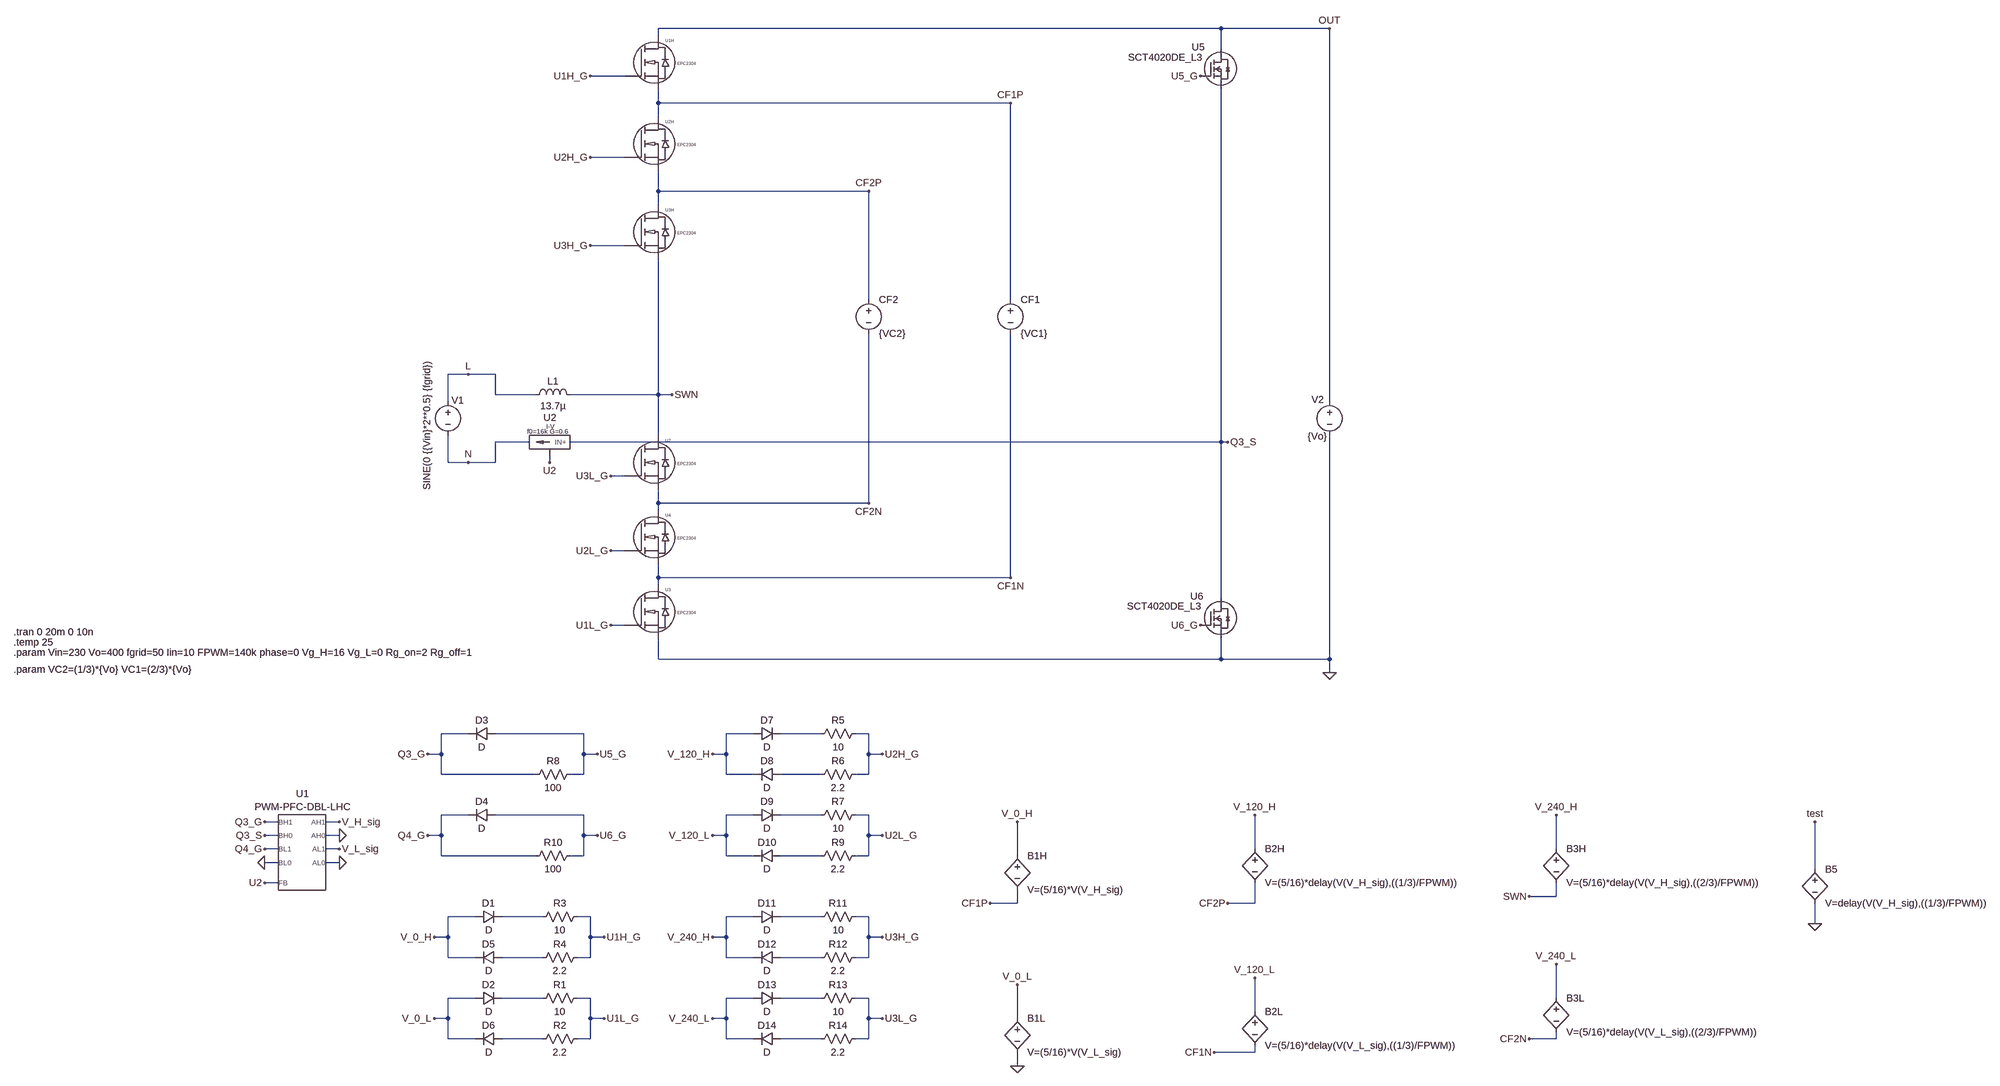
[diagram p0: schematic AC-DC Totem-Pole Bridgeless PFC Vin=200V Iin=100A Synchronous FETs.asc]
AC-DC Totem-Pole Bridgeless PFC Vin=200V Iin=100A Synchronous FETs.asc, the LTspice schematic file:
Version 4.1
SHEET 1 3608 1788
WIRE 1520 -688 192 -688
WIRE 1776 -688 1520 -688
WIRE 192 -672 192 -688
WIRE 1520 -640 1520 -688
WIRE 112 -576 32 -576
WIRE 192 -512 192 -544
WIRE 1024 -512 192 -512
WIRE 192 -480 192 -512
WIRE 112 -384 32 -384
WIRE 192 -304 192 -352
WIRE 688 -304 192 -304
WIRE 192 -272 192 -304
WIRE 112 -176 32 -176
WIRE 688 -48 688 -304
WIRE 1024 -48 1024 -512
WIRE -256 128 -304 128
WIRE -192 128 -256 128
WIRE -192 176 -192 128
WIRE -96 176 -192 176
WIRE 192 176 192 -144
WIRE 192 176 -16 176
WIRE 224 176 192 176
WIRE -304 192 -304 128
WIRE 1776 192 1776 -688
WIRE 192 272 192 176
WIRE -112 288 -192 288
WIRE 1520 288 1520 -544
WIRE 1520 288 -16 288
WIRE 1536 288 1520 288
WIRE -304 336 -304 272
WIRE -256 336 -304 336
WIRE -192 336 -192 288
WIRE -192 336 -256 336
WIRE -64 336 -64 320
WIRE 112 368 80 368
WIRE 192 432 192 400
WIRE 688 432 688 32
WIRE 688 432 192 432
WIRE 192 448 192 432
WIRE 112 544 80 544
WIRE 192 608 192 576
WIRE 1024 608 1024 32
WIRE 1024 608 192 608
WIRE 192 624 192 608
WIRE 1520 656 1520 288
WIRE 112 720 80 720
WIRE 192 800 192 752
WIRE 1520 800 1520 752
WIRE 1520 800 192 800
WIRE 1776 800 1776 272
WIRE 1776 800 1520 800
WIRE 1776 832 1776 800
WIRE -256 976 -320 976
WIRE 16 976 -192 976
WIRE 416 976 352 976
WIRE 576 976 480 976
WIRE 688 976 656 976
WIRE -320 1024 -320 976
WIRE -320 1024 -352 1024
WIRE 16 1024 16 976
WIRE 48 1024 16 1024
WIRE 352 1024 352 976
WIRE 352 1024 320 1024
WIRE 688 1024 688 976
WIRE 720 1024 688 1024
WIRE -320 1072 -320 1024
WIRE -96 1072 -320 1072
WIRE 16 1072 16 1024
WIRE 16 1072 -16 1072
WIRE 352 1072 352 1024
WIRE 416 1072 352 1072
WIRE 576 1072 480 1072
WIRE 688 1072 688 1024
WIRE 688 1072 656 1072
WIRE -256 1168 -320 1168
WIRE 16 1168 -192 1168
WIRE 416 1168 352 1168
WIRE 576 1168 480 1168
WIRE 688 1168 656 1168
WIRE -704 1184 -736 1184
WIRE -560 1184 -592 1184
WIRE -704 1216 -736 1216
WIRE -560 1216 -592 1216
WIRE -320 1216 -320 1168
WIRE -320 1216 -352 1216
WIRE 16 1216 16 1168
WIRE 48 1216 16 1216
WIRE 352 1216 352 1168
WIRE 352 1216 320 1216
WIRE 688 1216 688 1168
WIRE 720 1216 688 1216
WIRE -704 1248 -736 1248
WIRE -560 1248 -592 1248
WIRE 1600 1248 1600 1168
WIRE 2384 1248 2384 1168
WIRE -320 1264 -320 1216
WIRE -96 1264 -320 1264
WIRE 16 1264 16 1216
WIRE 16 1264 -16 1264
WIRE 352 1264 352 1216
WIRE 416 1264 352 1264
WIRE 576 1264 480 1264
WIRE 688 1264 688 1216
WIRE 688 1264 656 1264
WIRE 1040 1264 1040 1184
WIRE -704 1280 -736 1280
WIRE -560 1280 -592 1280
WIRE 3152 1296 3152 1184
WIRE -704 1328 -736 1328
WIRE 2384 1360 2384 1328
WIRE 2384 1360 2320 1360
WIRE 1040 1376 1040 1344
WIRE 1040 1376 976 1376
WIRE 1600 1376 1600 1328
WIRE 1600 1376 1536 1376
WIRE -240 1408 -304 1408
WIRE -80 1408 -176 1408
WIRE 32 1408 0 1408
WIRE 416 1408 352 1408
WIRE 576 1408 480 1408
WIRE 688 1408 656 1408
WIRE 3152 1424 3152 1376
WIRE -304 1456 -304 1408
WIRE -304 1456 -336 1456
WIRE 32 1456 32 1408
WIRE 64 1456 32 1456
WIRE 352 1456 352 1408
WIRE 352 1456 320 1456
WIRE 688 1456 688 1408
WIRE 720 1456 688 1456
WIRE -304 1504 -304 1456
WIRE -240 1504 -304 1504
WIRE -80 1504 -176 1504
WIRE 32 1504 32 1456
WIRE 32 1504 0 1504
WIRE 352 1504 352 1456
WIRE 416 1504 352 1504
WIRE 576 1504 480 1504
WIRE 688 1504 688 1456
WIRE 688 1504 656 1504
WIRE -240 1600 -304 1600
WIRE -80 1600 -176 1600
WIRE 32 1600 0 1600
WIRE 416 1600 352 1600
WIRE 576 1600 480 1600
WIRE 688 1600 656 1600
WIRE 2384 1600 2384 1520
WIRE 1600 1632 1600 1552
WIRE -304 1648 -304 1600
WIRE -304 1648 -336 1648
WIRE 32 1648 32 1600
WIRE 64 1648 32 1648
WIRE 352 1648 352 1600
WIRE 352 1648 320 1648
WIRE 688 1648 688 1600
WIRE 720 1648 688 1648
WIRE 1040 1648 1040 1568
WIRE -304 1696 -304 1648
WIRE -240 1696 -304 1696
WIRE -80 1696 -176 1696
WIRE 32 1696 32 1648
WIRE 32 1696 0 1696
WIRE 352 1696 352 1648
WIRE 416 1696 352 1696
WIRE 576 1696 480 1696
WIRE 688 1696 688 1648
WIRE 688 1696 656 1696
WIRE 2384 1696 2384 1680
WIRE 2384 1696 2320 1696
WIRE 1600 1728 1600 1712
WIRE 1600 1728 1504 1728
WIRE 1040 1760 1040 1728
FLAG 1776 832 0
FLAG 1776 -688 OUT
FLAG 224 176 SWN
FLAG 1536 288 Q3_S
FLAG -560 1184 V_H_sig
FLAG -560 1248 V_L_sig
FLAG -560 1280 0
FLAG -736 1184 Q3_G
FLAG -736 1216 Q3_S
FLAG -736 1248 Q4_G
FLAG -736 1280 0
FLAG -736 1328 U2
FLAG -64 336 U2
FLAG -336 1456 V_0_H
FLAG -336 1648 V_0_L
FLAG 64 1456 U1H_G
FLAG 64 1648 U1L_G
FLAG -352 1024 Q3_G
FLAG -352 1216 Q4_G
FLAG 48 1024 U5_G
FLAG 48 1216 U6_G
FLAG 32 -576 U1H_G
FLAG 80 720 U1L_G
FLAG 1472 -576 U5_G
FLAG 1472 720 U6_G
FLAG 1600 1168 V_120_H
FLAG 2384 1168 V_240_H
FLAG 1040 1760 0
FLAG 1040 1568 V_0_L
FLAG 1040 1184 V_0_H
FLAG -560 1216 0
FLAG -256 128 L
FLAG -256 336 N
FLAG 1600 1552 V_120_L
FLAG 2384 1520 V_240_L
FLAG 320 1024 V_120_H
FLAG 320 1216 V_120_L
FLAG 720 1024 U2H_G
FLAG 720 1216 U2L_G
FLAG 320 1456 V_240_H
FLAG 320 1648 V_240_L
FLAG 720 1456 U3H_G
FLAG 720 1648 U3L_G
FLAG 32 -384 U2H_G
FLAG 32 -176 U3H_G
FLAG 1024 -512 CF1P
FLAG 688 -304 CF2P
FLAG 80 544 U2L_G
FLAG 80 368 U3L_G
FLAG 1024 608 CF1N
FLAG 688 432 CF2N
FLAG 976 1376 CF1P
FLAG 1536 1376 CF2P
FLAG 2320 1360 SWN
FLAG 1504 1728 CF1N
FLAG 2320 1696 CF2N
FLAG 3152 1424 0
FLAG 3152 1184 test
SYMBOL ind -112 192 R270
WINDOW 0 32 56 VTop 2
WINDOW 3 5 56 VBottom 2
SYMATTR InstName L1
SYMATTR Value 13.7µ
SYMATTR SpiceLine Rser=4.2m
SYMBOL voltage -304 176 M0
WINDOW 123 0 0 Left 2
WINDOW 39 0 0 Left 2
WINDOW 3 49 -79 VRight 2
WINDOW 0 -38 13 Left 2
SYMATTR Value SINE(0 {{Vin}*2**0.5} {fgrid})
SYMATTR InstName V1
SYMBOL voltage 1776 176 M0
WINDOW 123 0 0 Left 2
WINDOW 39 0 0 Left 2
WINDOW 0 13 12 Left 2
WINDOW 3 6 98 Left 2
SYMATTR InstName V2
SYMATTR Value {Vo}
SYMBOL I-V -80 288 M0
WINDOW 0 -17 -42 Bottom 2
WINDOW 3 -18 -47 Top 1
WINDOW 39 -61 -25 Left 1
SYMATTR InstName U2
SYMATTR SpiceLine f0=16k G=0.6
SYMBOL res 16 1392 R90
WINDOW 0 0 56 VBottom 2
WINDOW 3 32 56 VTop 2
SYMATTR InstName R3
SYMATTR Value 10
SYMBOL res 16 1488 R90
WINDOW 0 0 56 VBottom 2
WINDOW 3 32 56 VTop 2
SYMATTR InstName R4
SYMATTR Value 2.2
SYMBOL res 0 1056 R90
WINDOW 0 0 56 VBottom 2
WINDOW 3 32 56 VTop 2
SYMATTR InstName R8
SYMATTR Value 100
SYMBOL res 0 1248 R90
WINDOW 0 0 56 VBottom 2
WINDOW 3 32 56 VTop 2
SYMATTR InstName R10
SYMATTR Value 100
SYMBOL SCT4020DE_L3 1472 -640 R0
WINDOW 0 -21 -4 Left 2
WINDOW 3 -171 20 Left 2
SYMATTR InstName U5
SYMBOL SCT4020DE_L3 1472 656 R0
WINDOW 0 -24 -4 Left 2
WINDOW 3 -173 19 Left 2
SYMATTR InstName U6
SYMBOL PWM-PFC-DBL-LHC -656 1312 R0
WINDOW 39 -367 56 Invisible 2
WINDOW 40 -368 90 Invisible 2
SYMATTR SpiceLine fps=fgrid phase=0 td1=15n td2=15n tr1=6.3n tf1=2.3n tr2=6.3n tf2=2.3n fsw=FPWM
SYMATTR SpiceLine2 Vg_H=16 Vg_L=0 Rso1=0 Rsi1=0 Rso2=0 Rsi2=0 f02=8k GA=12500 Vref=0.3
SYMATTR InstName U1
SYMBOL diode -192 960 R90
WINDOW 0 0 32 VBottom 2
WINDOW 3 32 32 VTop 2
SYMATTR InstName D3
SYMBOL diode -192 1152 R90
WINDOW 0 0 32 VBottom 2
WINDOW 3 32 32 VTop 2
SYMATTR InstName D4
SYMBOL bv 1600 1232 R0
SYMATTR InstName B2H
SYMATTR Value V=(5/16)*delay(V(V_H_sig),((1/3)/FPWM))
SYMBOL bv 2384 1232 R0
SYMATTR InstName B3H
SYMATTR Value V=(5/16)*delay(V(V_H_sig),((2/3)/FPWM))
SYMBOL diode -240 1392 M90
WINDOW 0 0 32 VBottom 2
WINDOW 3 32 32 VTop 2
SYMATTR InstName D1
SYMBOL diode -176 1520 M270
WINDOW 0 32 32 VTop 2
WINDOW 3 0 32 VBottom 2
SYMATTR InstName D5
SYMBOL res 16 1584 R90
WINDOW 0 0 56 VBottom 2
WINDOW 3 32 56 VTop 2
SYMATTR InstName R1
SYMATTR Value 10
SYMBOL res 16 1680 R90
WINDOW 0 0 56 VBottom 2
WINDOW 3 32 56 VTop 2
SYMATTR InstName R2
SYMATTR Value 2.2
SYMBOL diode -240 1584 M90
WINDOW 0 0 32 VBottom 2
WINDOW 3 32 32 VTop 2
SYMATTR InstName D2
SYMBOL diode -176 1712 M270
WINDOW 0 32 32 VTop 2
WINDOW 3 0 32 VBottom 2
SYMATTR InstName D6
SYMBOL bv 1040 1632 R0
SYMATTR InstName B1L
SYMATTR Value V=(5/16)*V(V_L_sig)
SYMBOL bv 1040 1248 R0
SYMATTR InstName B1H
SYMATTR Value V=(5/16)*V(V_H_sig)
SYMBOL bv 1600 1616 R0
SYMATTR InstName B2L
SYMATTR Value V=(5/16)*delay(V(V_L_sig),((1/3)/FPWM))
SYMBOL bv 2384 1584 R0
SYMATTR InstName B3L
SYMATTR Value V=(5/16)*delay(V(V_L_sig),((2/3)/FPWM))
SYMBOL res 672 960 R90
WINDOW 0 0 56 VBottom 2
WINDOW 3 32 56 VTop 2
SYMATTR InstName R5
SYMATTR Value 10
SYMBOL res 672 1056 R90
WINDOW 0 0 56 VBottom 2
WINDOW 3 32 56 VTop 2
SYMATTR InstName R6
SYMATTR Value 2.2
SYMBOL diode 416 960 M90
WINDOW 0 0 32 VBottom 2
WINDOW 3 32 32 VTop 2
SYMATTR InstName D7
SYMBOL diode 480 1088 M270
WINDOW 0 32 32 VTop 2
WINDOW 3 0 32 VBottom 2
SYMATTR InstName D8
SYMBOL res 672 1152 R90
WINDOW 0 0 56 VBottom 2
WINDOW 3 32 56 VTop 2
SYMATTR InstName R7
SYMATTR Value 10
SYMBOL res 672 1248 R90
WINDOW 0 0 56 VBottom 2
WINDOW 3 32 56 VTop 2
SYMATTR InstName R9
SYMATTR Value 2.2
SYMBOL diode 416 1152 M90
WINDOW 0 0 32 VBottom 2
WINDOW 3 32 32 VTop 2
SYMATTR InstName D9
SYMBOL diode 480 1280 M270
WINDOW 0 32 32 VTop 2
WINDOW 3 0 32 VBottom 2
SYMATTR InstName D10
SYMBOL res 672 1392 R90
WINDOW 0 0 56 VBottom 2
WINDOW 3 32 56 VTop 2
SYMATTR InstName R11
SYMATTR Value 10
SYMBOL res 672 1488 R90
WINDOW 0 0 56 VBottom 2
WINDOW 3 32 56 VTop 2
SYMATTR InstName R12
SYMATTR Value 2.2
SYMBOL diode 416 1392 M90
WINDOW 0 0 32 VBottom 2
WINDOW 3 32 32 VTop 2
SYMATTR InstName D11
SYMBOL diode 480 1520 M270
WINDOW 0 32 32 VTop 2
WINDOW 3 0 32 VBottom 2
SYMATTR InstName D12
SYMBOL res 672 1584 R90
WINDOW 0 0 56 VBottom 2
WINDOW 3 32 56 VTop 2
SYMATTR InstName R13
SYMATTR Value 10
SYMBOL res 672 1680 R90
WINDOW 0 0 56 VBottom 2
WINDOW 3 32 56 VTop 2
SYMATTR InstName R14
SYMATTR Value 2.2
SYMBOL diode 416 1584 M90
WINDOW 0 0 32 VBottom 2
WINDOW 3 32 32 VTop 2
SYMATTR InstName D13
SYMBOL diode 480 1712 M270
WINDOW 0 32 32 VTop 2
WINDOW 3 0 32 VBottom 2
SYMATTR InstName D14
SYMBOL EPCGaN 112 -576 R0
SYMATTR InstName U1H
SYMBOL EPCGaN 112 -384 R0
SYMATTR InstName U2H
SYMBOL EPCGaN 112 -176 R0
SYMATTR InstName U3H
SYMBOL EPCGaN 112 720 R0
SYMATTR InstName U3
SYMBOL EPCGaN 112 544 R0
SYMATTR InstName U4
SYMBOL EPCGaN 112 368 R0
SYMATTR InstName U7
SYMBOL bv 3152 1280 R0
SYMATTR InstName B5
SYMATTR Value V=delay(V(V_H_sig),((1/3)/FPWM))
SYMBOL voltage 688 -64 R0
SYMATTR InstName CF2
SYMATTR Value {VC2}
SYMBOL voltage 1024 -64 R0
SYMATTR InstName CF1
SYMATTR Value {VC1}
TEXT -1328 736 Left 2 !.tran 0 20m 0 10n
TEXT -1328 784 Left 2 !.param Vin=230 Vo=400 fgrid=50 Iin=10 FPWM=140k phase=0 Vg_H=16 Vg_L=0 Rg_on=2 Rg_off=1
TEXT -1328 760 Left 2 !.temp 25
TEXT -1328 824 Left 2 !.param VC2=(1/3)*{Vo} VC1=(2/3)*{Vo}

The netlist it stands for:
* AC-DC Totem-Pole Bridgeless PFC Vin=200V Iin=100A Synchronous FETs.asc
L1 L SWN 13.7µ Rser=4.2m
V1 L N SINE(0 {{Vin}*2**0.5} {fgrid})
V2 OUT 0 {Vo}
X§U2 Q3_S N U2 I-V f0=16k G=0.6  ; pins IN+ IN- OUT
R3 U1H_G N005 10
R4 U1H_G N007 2.2
R8 U5_G Q3_G 100
R10 U6_G Q4_G 100
X§U5 OUT U5_G Q3_S SCT4020DE_L3  ; pins D G S
X§U6 Q3_S U6_G 0 SCT4020DE_L3  ; pins D G S
X§U1 V_H_sig 0 V_L_sig 0 Q3_G Q3_S Q4_G 0 U2 PWM-PFC-DBL-LHC fps=fgrid phase=0 td1=15n td2=15n tr1=6.3n tf1=2.3n tr2=6.3n tf2=2.3n fsw=FPWM Vg_H=16 Vg_L=0 Rso1=0 Rsi1=0 Rso2=0 Rsi2=0 f02=8k GA=12500 Vref=0.3  ; pins AH1 AH0 AL1 AL0 BH1 BH0 BL1 BL0 FB
D3 U5_G Q3_G D
D4 U6_G Q4_G D
B2H V_120_H CF2P V=(5/16)*delay(V(V_H_sig),((1/3)/FPWM))
B3H V_240_H SWN V=(5/16)*delay(V(V_H_sig),((2/3)/FPWM))
D1 V_0_H N005 D
D5 N007 V_0_H D
R1 U1L_G N009 10
R2 U1L_G N011 2.2
D2 V_0_L N009 D
D6 N011 V_0_L D
B1L V_0_L 0 V=(5/16)*V(V_L_sig)
B1H V_0_H CF1P V=(5/16)*V(V_H_sig)
B2L V_120_L CF1N V=(5/16)*delay(V(V_L_sig),((1/3)/FPWM))
B3L V_240_L CF2N V=(5/16)*delay(V(V_L_sig),((2/3)/FPWM))
R5 U2H_G N001 10
R6 U2H_G N002 2.2
D7 V_120_H N001 D
D8 N002 V_120_H D
R7 U2L_G N003 10
R9 U2L_G N004 2.2
D9 V_120_L N003 D
D10 N004 V_120_L D
R11 U3H_G N006 10
R12 U3H_G N008 2.2
D11 V_240_H N006 D
D12 N008 V_240_H D
R13 U3L_G N010 10
R14 U3L_G N012 2.2
D13 V_240_L N010 D
D14 N012 V_240_L D
X§U1H U1H_G OUT CF1P EPC2304  ; pins gatein drainin sourcein
X§U2H U2H_G CF1P CF2P EPC2304  ; pins gatein drainin sourcein
X§U3H U3H_G CF2P SWN EPC2304  ; pins gatein drainin sourcein
X§U3 U1L_G CF1N 0 EPC2304  ; pins gatein drainin sourcein
X§U4 U2L_G CF2N CF1N EPC2304  ; pins gatein drainin sourcein
X§U7 U3L_G SWN CF2N EPC2304  ; pins gatein drainin sourcein
B5 test 0 V=delay(V(V_H_sig),((1/3)/FPWM))
V§CF2 CF2P CF2N {VC2}
V§CF1 CF1P CF1N {VC1}
.model D D
.lib standard.dio
.tran 0 20m 0 10n
.param Vin=230 Vo=400 fgrid=50 Iin=10 FPWM=140k phase=0 Vg_H=16 Vg_L=0 Rg_on=2 Rg_off=1
.temp 25
.param VC2=(1/3)*{Vo} VC1=(2/3)*{Vo}
.lib SS I-V.lib
.lib SCT4020DE_L3.lib
.lib SS PWM-PFC-DBL-LHC.lib
.lib EPCGanlibrary.lib
.backanno
.end